# EAGLE design qtwov3_schem (EAGLE 7.6.0)
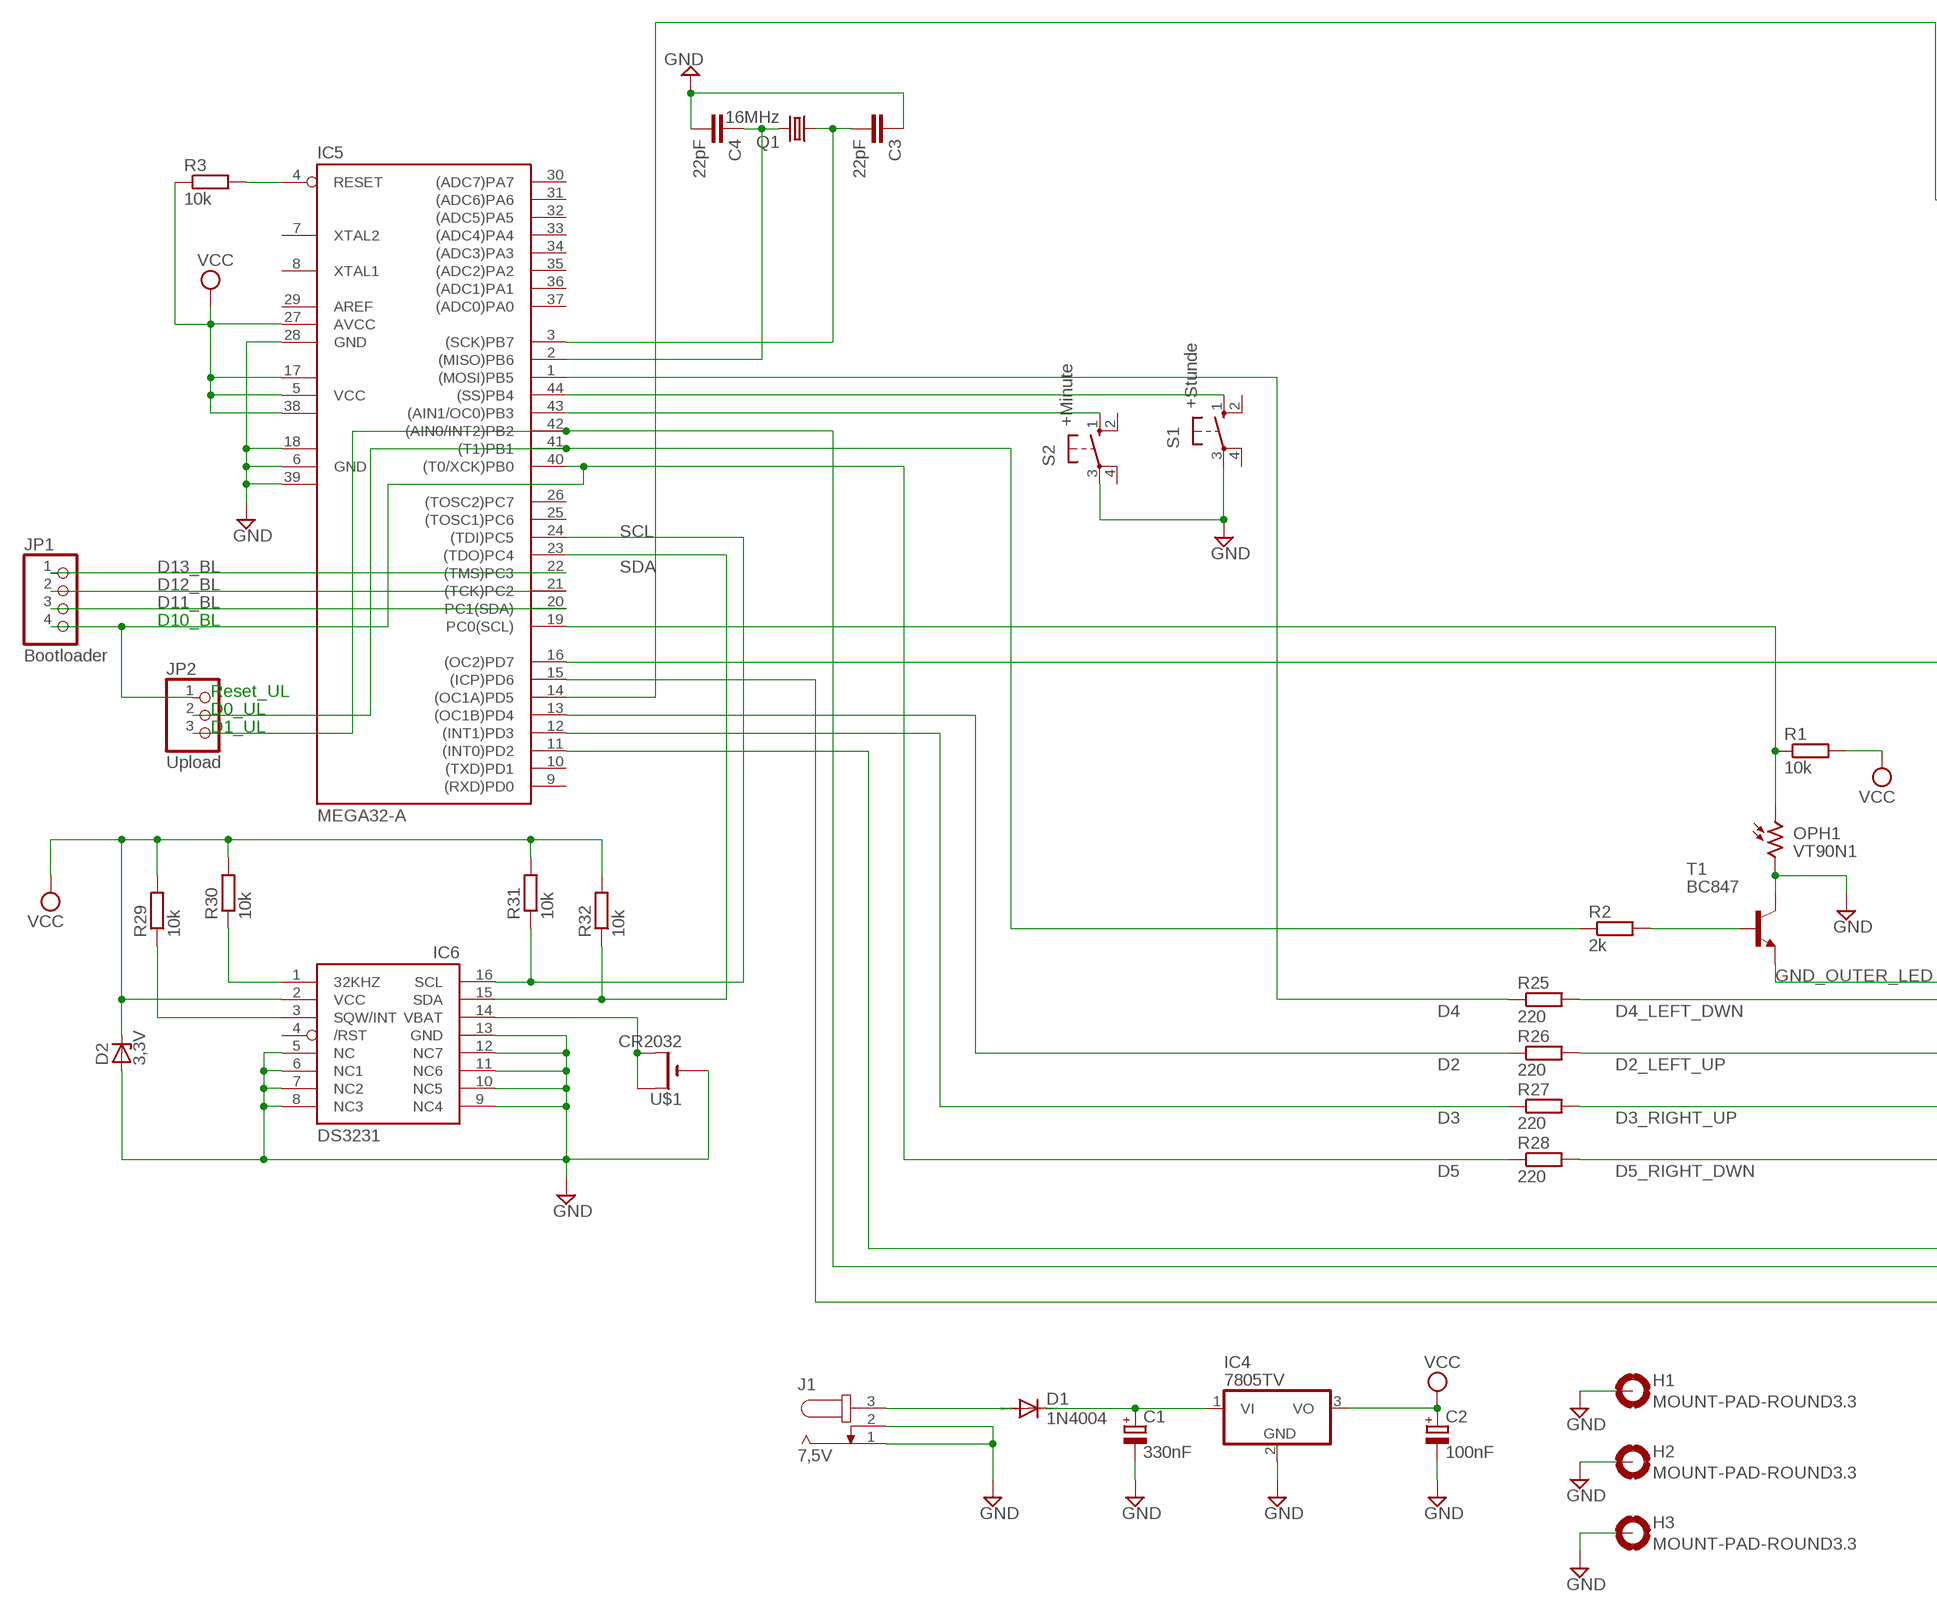
[diagram p0: schematic, sheet 1, part 1 of 2]
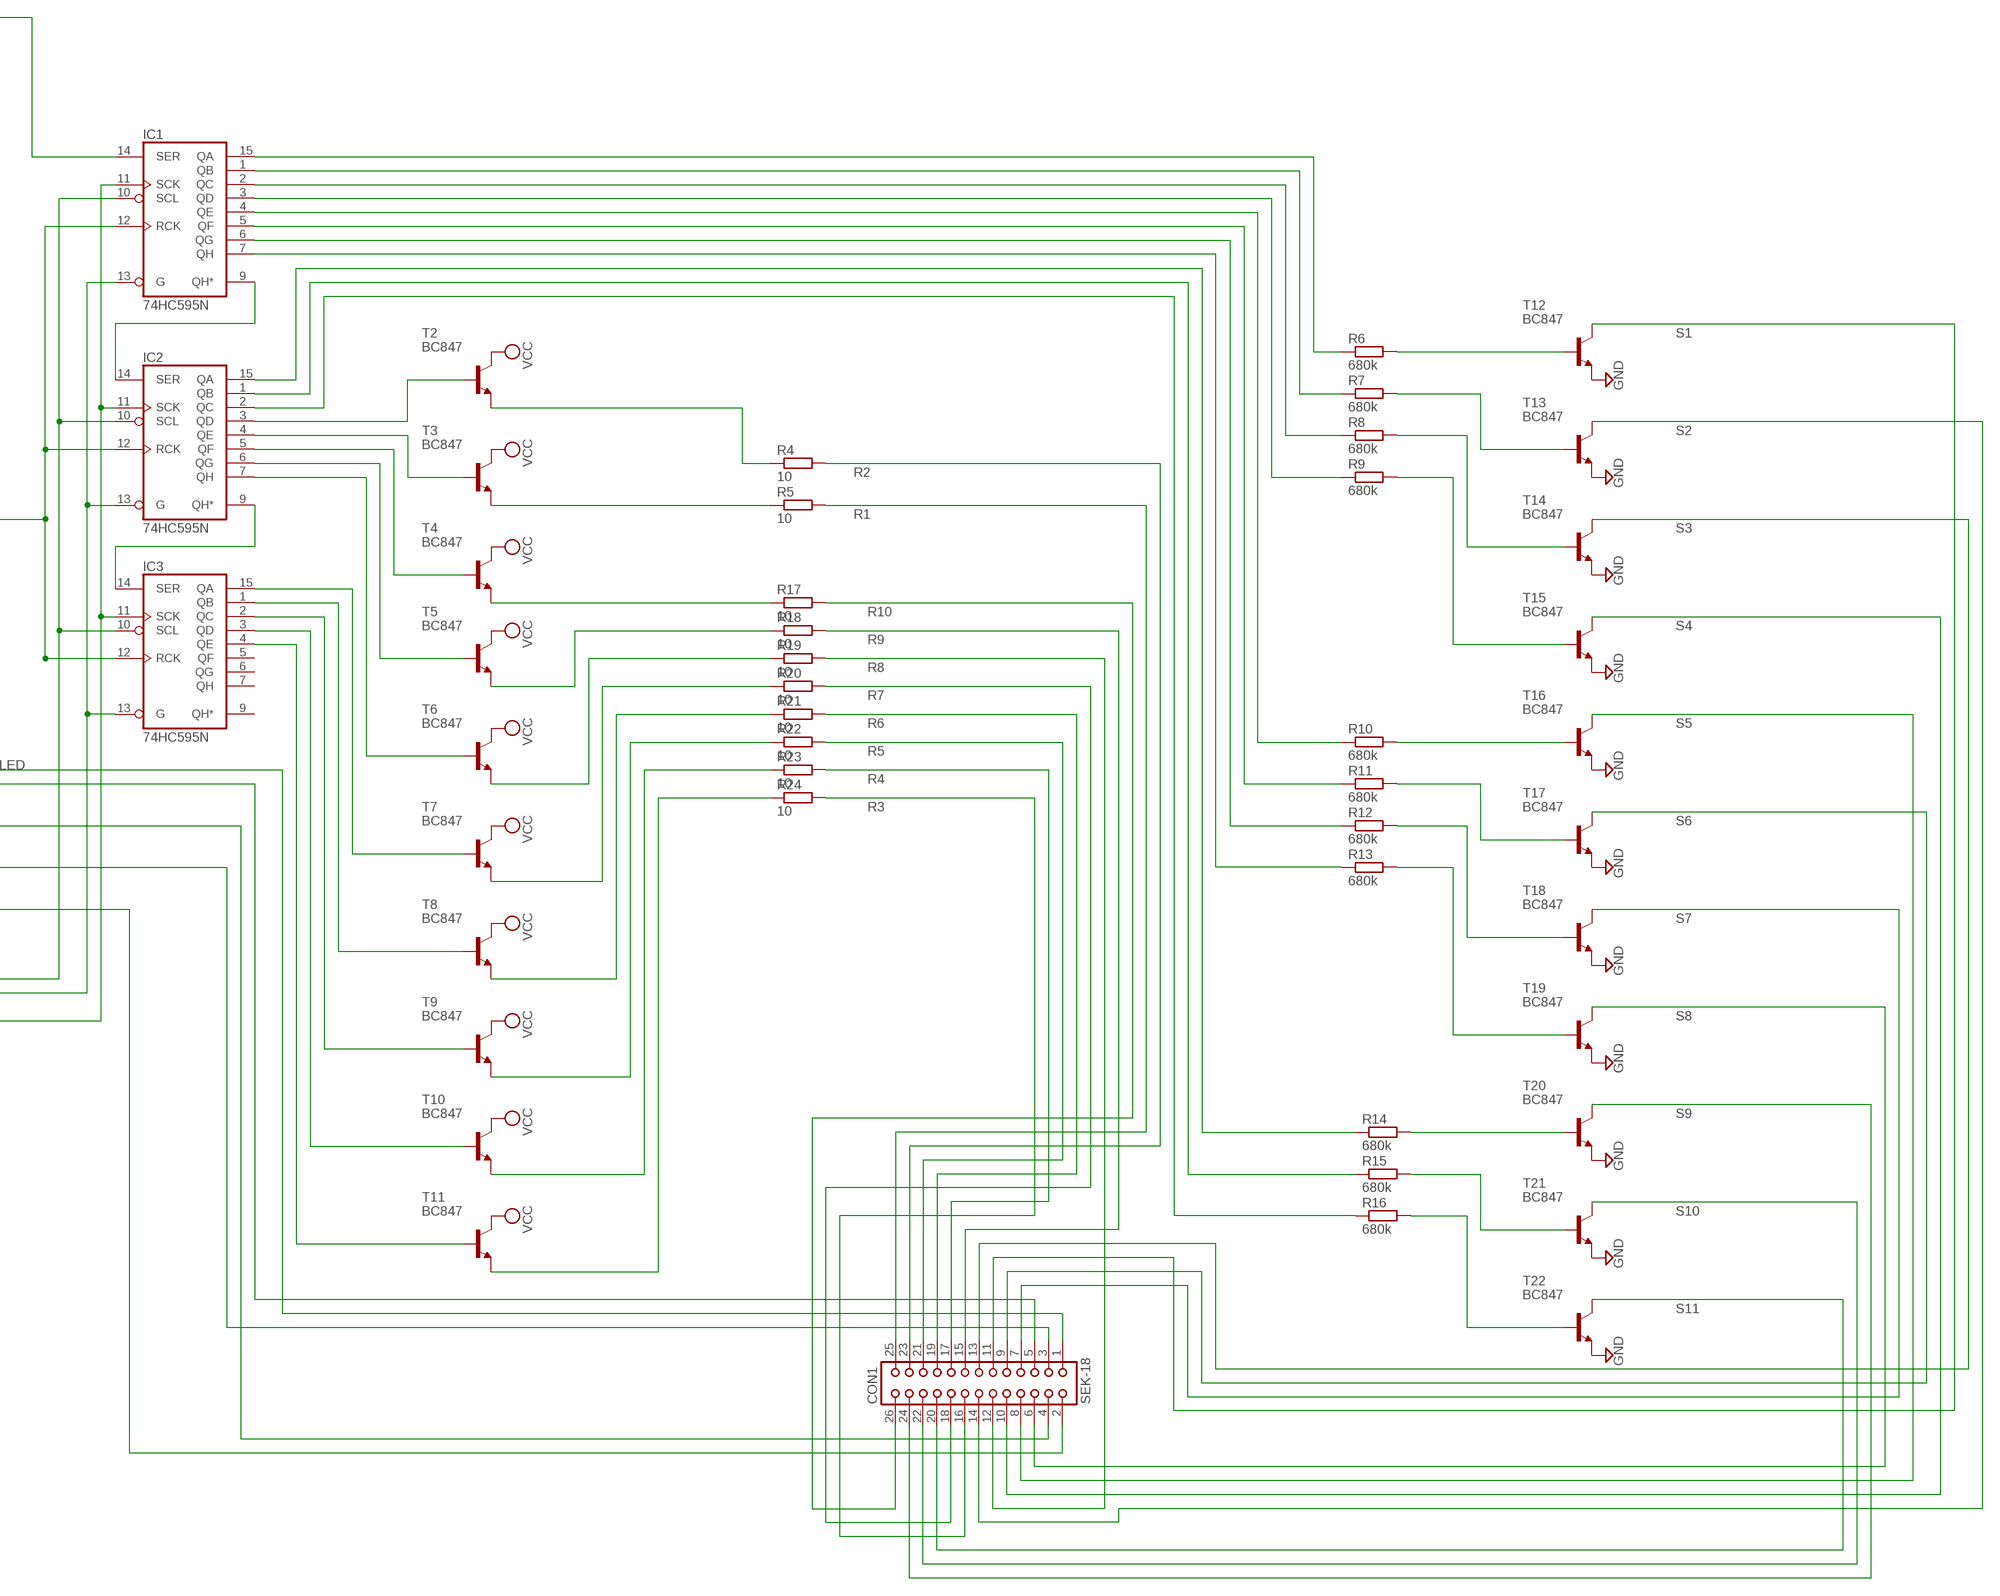
[diagram p1: schematic, sheet 1, part 2 of 2]

## Parts
C1  330nF  CPOL-EUA/3216-18R  [A/3216-18R]
C2  100nF  CPOL-EUA/3216-18R  [A/3216-18R]
C3  22pF  C-EUC3216  [C3216]
C4  22pF  C-EUC3216  [C3216]
CON1  SEK-18  CON26  [CON26]
D1  1N4004  [DO41-10]
D2  3,3V  ZENER-DIODEP1-12  [P1Z12]
H1  MOUNT-PAD-ROUND3.3  [3,3-PAD]
H2  MOUNT-PAD-ROUND3.3  [3,3-PAD]
H3  MOUNT-PAD-ROUND3.3  [3,3-PAD]
IC1  74HC595N  [DIL16]
IC2  74HC595N  [DIL16]
IC3  74HC595N  [DIL16]
IC4  7805TV  [TO220V]
IC5  MEGA32-A  [TQFP44]
IC6  DS3231/SO  [SO16W]
J1  7,5V  JACK-PLUG1  [SPC4078]
JP1  Bootloader  PINHD-1X4  [1X04]
JP2  Upload  PINHD-1X3  [1X03]
OPH1  VT90N1  [VT900]
Q1  16MHz  CRYSTALHC49S  [HC49/S]
R1  10k  R-EU_M3216  [M3216]
R2  2k  R-EU_M3216  [M3216]
R3  10k  R-EU_M3216  [M3216]
R4  10  R-EU_M3216  [M3216]
R5  10  R-EU_M3216  [M3216]
R6  680k  R-EU_M3216  [M3216]
R7  680k  R-EU_M3216  [M3216]
R8  680k  R-EU_M3216  [M3216]
R9  680k  R-EU_M3216  [M3216]
R10  680k  R-EU_M3216  [M3216]
R11  680k  R-EU_M3216  [M3216]
R12  680k  R-EU_M3216  [M3216]
R13  680k  R-EU_M3216  [M3216]
R14  680k  R-EU_M3216  [M3216]
R15  680k  R-EU_M3216  [M3216]
R16  680k  R-EU_M3216  [M3216]
R17  10  R-EU_M3216  [M3216]
R18  10  R-EU_M3216  [M3216]
R19  10  R-EU_M3216  [M3216]
R20  10  R-EU_M3216  [M3216]
R21  10  R-EU_M3216  [M3216]
R22  10  R-EU_M3216  [M3216]
R23  10  R-EU_M3216  [M3216]
R24  10  R-EU_M3216  [M3216]
R25  220  R-EU_M3216  [M3216]
R26  220  R-EU_M3216  [M3216]
R27  220  R-EU_M3216  [M3216]
R28  220  R-EU_M3216  [M3216]
R29  10k  R-EU_M3216  [M3216]
R30  10k  R-EU_M3216  [M3216]
R31  10k  R-EU_M3216  [M3216]
R32  10k  R-EU_M3216  [M3216]
S1  +Stunde  10-XX  [B3F-10XX]
S2  +Minute  10-XX  [B3F-10XX]
T1  BC847  [SOT23]
T2  BC847  [SOT23]
T3  BC847  [SOT23]
T4  BC847  [SOT23]
T5  BC847  [SOT23]
T6  BC847  [SOT23]
T7  BC847  [SOT23]
T8  BC847  [SOT23]
T9  BC847  [SOT23]
T10  BC847  [SOT23]
T11  BC847  [SOT23]
T12  BC847  [SOT23]
T13  BC847  [SOT23]
T14  BC847  [SOT23]
T15  BC847  [SOT23]
T16  BC847  [SOT23]
T17  BC847  [SOT23]
T18  BC847  [SOT23]
T19  BC847  [SOT23]
T20  BC847  [SOT23]
T21  BC847  [SOT23]
T22  BC847  [SOT23]
U$1  CR2032  CR2032THM  [CR2032-THRU]

## Nets
D2: IC5.13((OC1B)PD4) R26.1
D2_LEFT_UP: CON1.4 R26.2
D3: IC5.12((INT1)PD3) R27.1
D3_RIGHT_UP: CON1.3 R27.2
D4: IC5.1((MOSI)PB5) R25.1
D4_LEFT_DWN: CON1.5 R25.2
D5: IC5.40((T0/XCK)PB0) JP1.4 JP2.1 R28.1
D5_RIGHT_DWN: CON1.2 R28.2
D11_BL: IC5.20(PC1(SDA)) JP1.3
D12_BL: IC5.21((TCK)PC2) JP1.2
D13_BL: IC5.22((TMS)PC3) JP1.1
GND: C1.- C2.- C3.1 C4.2 D2.A H1.B3,3(MOUNT) H2.B3,3(MOUNT) H3.B3,3(MOUNT) IC4.2(GND) IC5.6(GND) IC5.18(GND1) IC5.28(GND) IC5.39(GND2) IC6.5(NC) IC6.6(NC1) IC6.7(NC2) IC6.8(NC3) IC6.9(NC4) IC6.10(NC5) IC6.11(NC6) IC6.12(NC7) IC6.13(GND) J1.1 J1.2 OPH1.2 S1.3(P) S2.3(P) T1.3(C) T12.2(E) T13.2(E) T14.2(E) T15.2(E) T16.2(E) T17.2(E) T18.2(E) T19.2(E) T20.2(E) T21.2(E) T22.2(E) U$1.-
GND_OUTER_LED: CON1.1 T1.2(E)
N$1: C1.+ D1.C IC4.1(VI)
N$2: D1.A J1.3
N$3: IC6.1(32KHZ) R30.1
N$4: IC6.3(SQW/INT) R29.1
N$5: IC5.19(PC0(SCL)) OPH1.1 R1.1
N$6: IC5.44((SS)PB4) S1.1(S)
N$7: IC5.43((AIN1/OC0)PB3) S2.1(S)
N$8: IC1.10(SCL) IC2.10(SCL) IC3.10(SCL) IC5.11((INT0)PD2)
N$9: IC5.41((T1)PB1) JP2.2 R2.1
N$10: R2.2 T1.1(B)
N$11: IC1.13(G) IC2.13(G) IC3.13(G) IC5.42((AIN0/INT2)PB2) JP2.3
N$12: IC1.11(SCK) IC2.11(SCK) IC3.11(SCK) IC5.15((ICP)PD6)
N$13: IC1.12(RCK) IC2.12(RCK) IC3.12(RCK) IC5.16((OC2)PD7)
N$14: IC1.14(SER) IC5.14((OC1A)PD5)
N$15: IC1.9(QH*) IC2.14(SER)
N$16: IC2.9(QH*) IC3.14(SER)
N$17: IC2.3(QD) T2.1(B)
N$18: IC2.4(QE) T3.1(B)
N$19: IC2.5(QF) T4.1(B)
N$20: IC2.6(QG) T5.1(B)
N$21: IC2.7(QH) T6.1(B)
N$22: IC3.15(QA) T7.1(B)
N$23: IC3.1(QB) T8.1(B)
N$24: IC3.2(QC) T9.1(B)
N$25: IC3.3(QD) T10.1(B)
N$26: IC3.4(QE) T11.1(B)
N$27: R6.2 T12.1(B)
N$28: R7.2 T13.1(B)
N$29: R8.2 T14.1(B)
N$30: R9.2 T15.1(B)
N$31: R10.2 T16.1(B)
N$32: R11.2 T17.1(B)
N$33: R12.2 T18.1(B)
N$34: R13.2 T19.1(B)
N$35: R14.2 T20.1(B)
N$36: R15.2 T21.1(B)
N$37: R16.2 T22.1(B)
N$38: IC1.15(QA) R6.1
N$39: IC1.1(QB) R7.1
N$40: IC1.2(QC) R8.1
N$41: IC1.3(QD) R9.1
N$42: IC1.4(QE) R10.1
N$43: IC1.5(QF) R11.1
N$44: IC1.6(QG) R12.1
N$45: IC1.7(QH) R13.1
N$46: IC2.15(QA) R14.1
N$47: IC2.1(QB) R15.1
N$48: IC2.2(QC) R16.1
N$49: R4.1 T2.2(E)
N$50: R5.1 T3.2(E)
N$51: R17.1 T4.2(E)
N$52: R18.1 T5.2(E)
N$53: R19.1 T6.2(E)
N$54: R20.1 T7.2(E)
N$55: R21.1 T8.2(E)
N$56: R22.1 T9.2(E)
N$57: R23.1 T10.2(E)
N$58: R24.1 T11.2(E)
N$59: IC6.14(VBAT) U$1.+1(+) U$1.+2(+1)
N$60: C4.1 IC5.2((MISO)PB6) Q1.2
N$61: C3.2 IC5.3((SCK)PB7) Q1.1
N$62: IC5.4(RESET) R3.2
R1: CON1.25 R5.2
R2: CON1.23 R4.2
R3: CON1.16 R24.2
R4: CON1.17 R23.2
R5: CON1.21 R22.2
R6: CON1.19 R21.2
R7: CON1.18 R20.2
R8: CON1.12 R19.2
R9: CON1.15 R18.2
R10: CON1.26 R17.2
S1: CON1.11 T12.3(C)
S2: CON1.14 T13.3(C)
S3: CON1.13 T14.3(C)
S4: CON1.10 T15.3(C)
S5: CON1.8 T16.3(C)
S6: CON1.9 T17.3(C)
S7: CON1.7 T18.3(C)
S8: CON1.6 T19.3(C)
S9: CON1.24 T20.3(C)
S10: CON1.22 T21.3(C)
S11: CON1.20 T22.3(C)
SCL: IC5.24((TDI)PC5) IC6.16(SCL) R31.1
SDA: IC5.23((TDO)PC4) IC6.15(SDA) R32.1
VCC: C2.+ D2.C IC4.3(VO) IC5.5(VCC) IC5.17(VCC1) IC5.27(AVCC) IC5.38(VCC2) IC6.2(VCC) R1.2 R3.1 R29.2 R30.2 R31.2 R32.2 T2.3(C) T3.3(C) T4.3(C) T5.3(C) T6.3(C) T7.3(C) T8.3(C) T9.3(C) T10.3(C) T11.3(C)
Unconnected: IC3.5(QF) IC3.6(QG) IC3.7(QH) IC3.9(QH*) IC5.7(XTAL2) IC5.8(XTAL1) IC5.9((RXD)PD0) IC5.10((TXD)PD1) IC5.25((TOSC1)PC6) IC5.26((TOSC2)PC7) IC5.29(AREF) IC5.30((ADC7)PA7) IC5.31((ADC6)PA6) IC5.32((ADC5)PA5) IC5.33((ADC4)PA4) IC5.34((ADC3)PA3) IC5.35((ADC2)PA2) IC5.36((ADC1)PA1) IC5.37((ADC0)PA0) IC6.4(/RST) S1.2(S1) S1.4(P1) S2.2(S1) S2.4(P1)

## Notes on the sheet
- D10_BL
- Reset_UL
- D0_UL
- D1_UL

## Power pins joined to a net without a drawn wire
GND: IC1.8(GND) IC2.8(GND) IC3.8(GND)
VCC: IC1.16(VCC) IC2.16(VCC) IC3.16(VCC)

## Library data of the parts
C1 C2 = rcl:CPOL-EU: POLARIZED CAPACITOR, European symbol
C3 C4 = rcl:C-EU: CAPACITOR, European symbol
CON1 = con-harting:CON26: CONNECTOR; OC_FARNELL: unknown; OC_NEWARK: unknown
D1 = diode:1N4004: DIODE general purpose rectifier, 1 A
D2 = diode:ZENER-DIODE: Z-Diode
H1-H3 = holes:MOUNT-PAD-ROUND: MOUNTING PAD, round
IC1-IC3 = 74xx-eu:74*595: 8-bit SHIFT REGISTER, output latch
IC4 = linear:78*: Positive VOLTAGE REGULATOR Source: http://cache.national.com/ds/LM/LM78L05.pdf http://www.fairchildsemi.com/ds/LM/LM7805.pdf
IC5 = atmel:MEGA32: MICROCONTROLLER 32 Kbytes FLASH 2 Kbytes SRAM 1 Kbytes EEPROM USART 8-channel 10 bit ADC Source: www.atmel.com .. doc2503.pdf; MPN: ATMEGA32-16AU; OC_FARNELL: 9171274; OC_NEWARK: 69K6677
IC6 = adafruit:DS3231
J1 = con-jack:JACK-PLUG: DC POWER JACK Power Jack, DC, Right Angle, Through Hole, Rated 5A at 16VDC, PC Terminals Distributor: Farnell (www.Farnell.de) Drawing: 84N1161.pdf / 84N1162.pdf Manufacturer: SPC Technology (www.spctechnology.com) Type: SPC4077 / SPC 4078; OC_FARNELL: unknown; OC_NEWARK: unknown
JP1 = pinhead:PINHD-1X4: PIN HEADER
JP2 = pinhead:PINHD-1X3: PIN HEADER
OPH1 = photo-elements:VT9: Photoconductive Cell VT900 Series Source: http://optoelectronics.perkinelmer.com/content/Datasheets/DTS_vt900seriesdatasheet.pdf
Q1 = crystal:CRYSTAL: CRYSTAL; OC_FARNELL: 1667008; OC_NEWARK: unknown
R1-R32 = rcl:R-EU_: RESISTOR, European symbol
S1 S2 = switch-omron:10-XX: OMRON SWITCH; MPN: B3F-1000; OC_FARNELL: 176432; OC_NEWARK: 36M3542
T1-T22 = transistor:BC847: NPN TRANSISTOR
U$1 = adafruit:CR2032

## Board
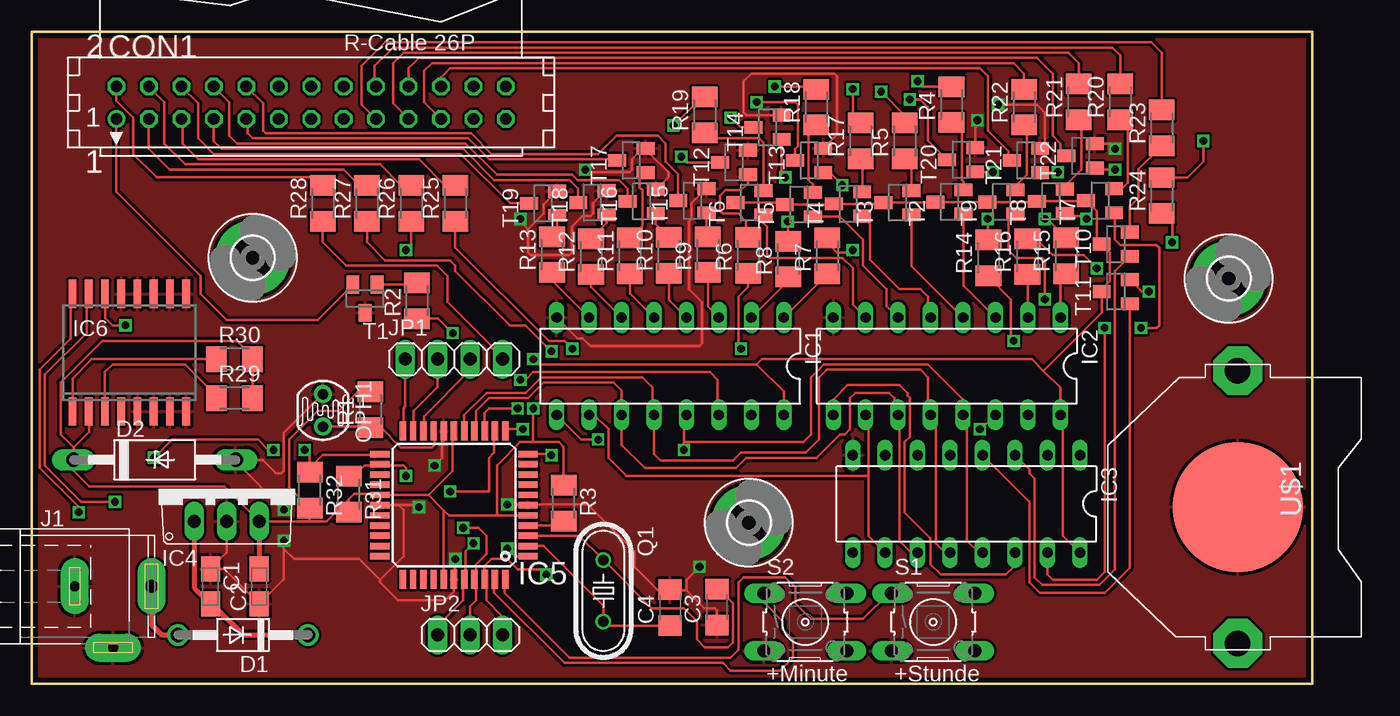
[diagram p2: board, top side]
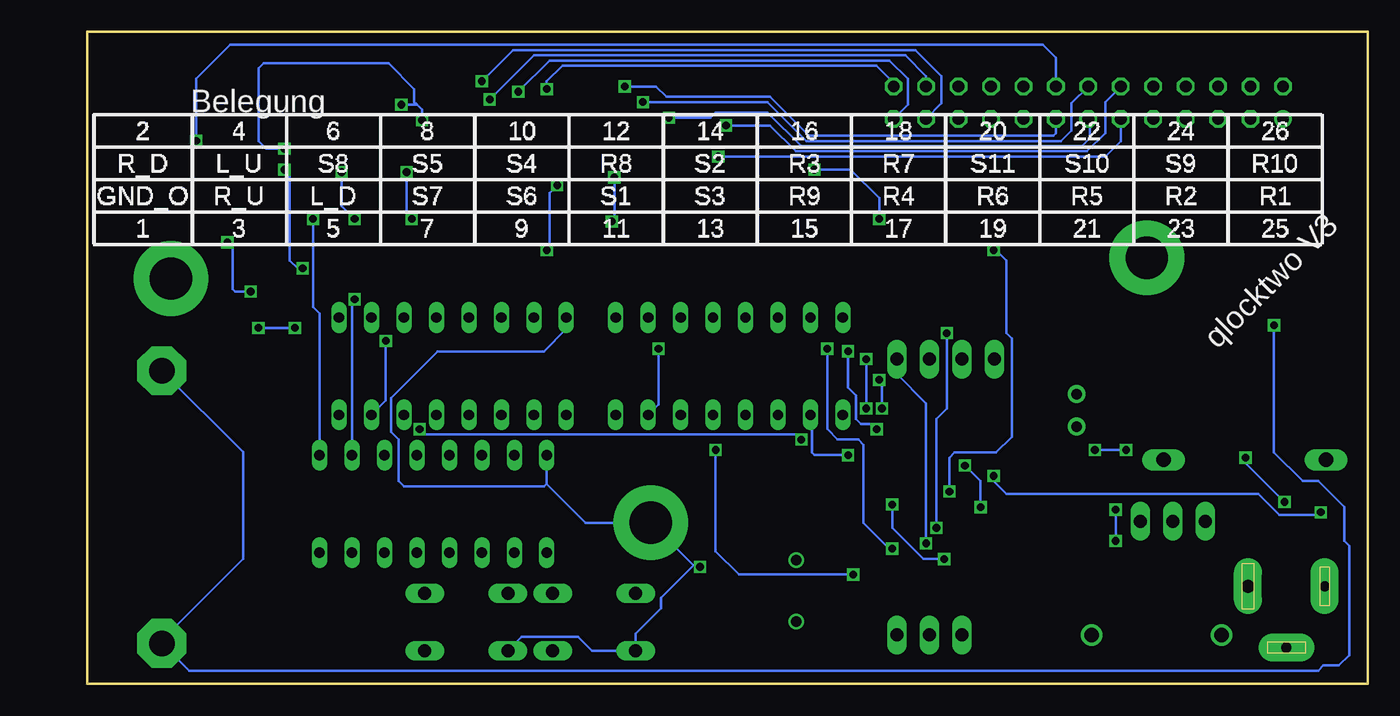
[diagram p3: board, bottom side, seen from below]

Size 100.18 x 51 mm. Coordinates in mm from the lower left corner, seen from the top.
Outline: 0,0 100.18,0 100.18,51 0,51 0,0
Copper layers (1*16): Top 0.0356mm / dielectric 1.5011mm / Bottom 0.0356mm
Design rules "oshpark-2layer": minimum track width 8mil, minimum drill 13mil, track to track 8mil, track to pad 8mil, pad to pad 8mil, via to via 8mil, smd to smd 8mil, copper to edge 15mil, drill to drill 8mil, minimum pad ring 7mil, minimum via ring 7mil, stop-mask expansion 2.5mil, vias tented up to drill 0mil, thermal gap 10mil

### Footprints (pad centres in the part's own frame; a part is rotated, then mirrored left to right if it is on the bottom)
A/3216-18R = smd 1.95 x 1.5: + 1.375,0; - -1.375,0
C3216 = smd 1.6 x 1.8: 1 -1.4,0; 2 1.4,0
CON26 = drill 0.914: 1 -15.24,-1.27 | drill 0.914 octagon: 2 -15.24,1.27; 3 -12.7,-1.27; 4 -12.7,1.27; 5 -10.16,-1.27; 6 -10.16,1.27; 7 -7.62,-1.27; 8 -7.62,1.27; 9 -5.08,-1.27; 10 -5.08,1.27; 11 -2.54,-1.27; 12 -2.54,1.27; 13 0,-1.27; 14 0,1.27; 15 2.54,-1.27; 16 2.54,1.27; 17 5.08,-1.27; 18 5.08,1.27; 19 7.62,-1.27; 20 7.62,1.27; 21 10.16,-1.27; 22 10.16,1.27; 23 12.7,-1.27; 24 12.7,1.27; 25 15.24,-1.27; 26 15.24,1.27
DO41-10 = drill 1.118: A 5.08,0; C -5.08,0
P1Z12 = drill 1.118 long: A 6.35,0; C -6.35,0
3,3-PAD = drill 3.3 pad 5.842: B3,3 0,0
DIL16 = drill 0.813 long: 1 -8.89,-3.81; 2 -6.35,-3.81; 3 -3.81,-3.81; 4 -1.27,-3.81; 5 1.27,-3.81; 6 3.81,-3.81; 7 6.35,-3.81; 8 8.89,-3.81; 9 8.89,3.81; 10 6.35,3.81; 11 3.81,3.81; 12 1.27,3.81; 13 -1.27,3.81; 14 -3.81,3.81; 15 -6.35,3.81; 16 -8.89,3.81
TO220V = drill 1.016 long: 1 -2.54,-2.54; 2 0,-2.54; 3 2.54,-2.54
TQFP44 = smd 1.5 x 0.5: 1 -5.8,4; 2 -5.8,3.2; 3 -5.8,2.4; 4 -5.8,1.6; 5 -5.8,0.8; 6 -5.8,0; 7 -5.8,-0.8; 8 -5.8,-1.6; 9 -5.8,-2.4; 10 -5.8,-3.2; 11 -5.8,-4; 23 5.8,-4; 24 5.8,-3.2; 25 5.8,-2.4; 26 5.8,-1.6; 27 5.8,-0.8; 28 5.8,0; 29 5.8,0.8; 30 5.8,1.6; 31 5.8,2.4; 32 5.8,3.2; 33 5.8,4 | smd 0.5 x 1.5: 12 -4,-5.8; 13 -3.2,-5.8; 14 -2.4,-5.8; 15 -1.6,-5.8; 16 -0.8,-5.8; 17 0,-5.8; 18 0.8,-5.8; 19 1.6,-5.8; 20 2.4,-5.8; 21 3.2,-5.8; 22 4,-5.8; 34 4,5.8; 35 3.2,5.8; 36 2.4,5.8; 37 1.6,5.8; 38 0.8,5.8; 39 0,5.8; 40 -0.8,5.8; 41 -1.6,5.8; 42 -2.4,5.8; 43 -3.2,5.8; 44 -4,5.8
SO16W = smd 0.6 x 2.2: 1 -4.445,-4.6; 2 -3.175,-4.6; 3 -1.905,-4.6; 4 -0.635,-4.6; 5 0.635,-4.6; 6 1.905,-4.6; 7 3.175,-4.6; 8 4.445,-4.6; 9 4.445,4.6; 10 3.175,4.6; 11 1.905,4.6; 12 0.635,4.6; 13 -0.635,4.6; 14 -1.905,4.6; 15 -3.175,4.6; 16 -4.445,4.6
SPC4078 = drill 0.8 pad 2.184 long: 1 -3,0; 2 0,-4.8 | drill 1 pad 2.184 long: 3 3,0
1X04 = drill 1.016 long: 1 -3.81,0; 2 -1.27,0; 3 1.27,0; 4 3.81,0
1X03 = drill 1.016 long: 1 -2.54,0; 2 0,0; 3 2.54,0
VT900 = drill 0.8 pad 1.4: 1 -1.27,0; 2 1.27,0
HC49/S = drill 0.813: 1 -2.413,0; 2 2.413,0
M3216 = smd 1.6 x 2: 1 -1.4,0; 2 1.4,0
B3F-10XX = drill 1.016 long: 1 -3.251,2.261; 2 3.251,2.261; 3 -3.251,-2.261; 4 3.251,-2.261
SOT23 = smd 1 x 1.4: 1 -0.95,-1.1; 2 0.95,-1.1; 3 0,1.1
CR2032-THRU = drill 2 pad 3.81 octagon: +1 -10.668,0; +2 10.668,0 | smd 10.16 x 10.16: - 0,0

### Placement (x,y rotation side)
C1  13.97,7.62 270 top
C2  17.78,7.62 90 top
C3  53.59,5.99 90 top
C4  49.94,5.94 90 top
CON1  21.84,45.47 0 top
D1  16.51,3.81 180 top
D2  9.6,17.53 0 top
H1  93.62,31.7 0 top
H2  56.08,12.6 0 top
H3  17.27,33.32 0 top
IC1  49.94,24.84 180 top
IC2  71.58,24.84 180 top
IC3  73.1,14.07 180 top
IC4  15.24,15.24 0 top
IC5  33.02,13.97 180 top
IC6  7.62,25.91 0 top
J1  6.35,7.62 0 top
JP1  33.02,25.4 0 top
JP2  34.29,3.81 0 top
OPH1  22.76,21.39 90 top
Q1  44.7,7.26 270 top
R1  26.47,21.44 90 top
R2  30.12,29.97 90 top
R3  41.61,14.12 270 top
R4  71.93,45.31 90 top
R5  68.28,42.47 90 top
R6  56.03,33.53 90 top
R7  62.23,33.48 90 top
R8  59.18,33.22 90 top
R9  52.88,33.58 90 top
R10  49.83,33.53 90 top
R11  46.79,33.48 90 top
R12  43.74,33.43 90 top
R13  40.69,33.58 90 top
R14  74.83,33.32 90 top
R15  80.92,33.48 90 top
R16  77.88,33.43 90 top
R17  64.82,42.47 90 top
R18  61.37,45.11 90 top
R19  52.63,44.5 90 top
R20  85.14,45.52 90 top
R21  81.89,45.52 90 top
R22  77.62,45.11 90 top
R23  88.39,43.48 90 top
R24  88.39,38.2 90 top
R25  33.12,37.59 90 top
R26  29.67,37.59 90 top
R27  26.21,37.59 90 top
R28  22.76,37.59 90 top
R29  15.85,22.35 0 top
R30  15.85,25.4 0 top
R31  24.79,14.83 270 top
R32  21.74,15.14 270 top
S1  70.51,4.83 0 top
S2  60.5,4.83 0 top
T1  26.06,30.12 180 top
T2  71.78,37.69 90 top
T3  67.72,37.64 90 top
T4  63.86,37.54 90 top
T5  59.99,37.49 90 top
T6  56.13,37.64 90 top
T7  83.57,37.8 90 top
T8  79.71,37.74 90 top
T9  75.84,37.69 90 top
T10  84.79,34.39 90 top
T11  84.79,30.68 90 top
T12  54.91,40.79 90 top
T13  60.81,40.94 90 top
T14  57.56,43.54 90 top
T15  51.66,37.8 90 top
T16  47.7,37.74 90 top
T17  46.89,40.94 90 top
T18  43.84,37.64 90 top
T19  39.98,37.59 90 top
T20  72.69,41 90 top
T21  77.77,40.94 90 top
T22  82.04,41.3 90 top
U$1  94.34,13.82 270 top

### Tracks (layer width: path | path; a pad name or v marks a point on that pad's centre or on a via)
D2  (via drill 0.6)
  Top 0.203: R26.1 29.67,34.34 v29.26,33.93 | v32.72,15.04 35.76,15.04 35.76,17.68 36.17,18.09 36.17,19.72 IC5.13
  Bottom 0.203: v29.26,33.93 29.06,33.93 28.25,33.12 28.25,27.43 27.84,27.03 27.84,19.3 29.06,18.09 32.31,18.09 32.72,17.68 v32.72,15.04
D2_LEFT_UP
  Top 0.203: R26.2 28.88,38.99 27.23,40.64 11.99,40.64 10.36,42.27 10.36,45.52 CON1.4
D3  (via drill 0.6)
  Top 0.203: R27.1 26.21,34.54 27.64,33.12 32.72,33.12 33.12,32.72 33.12,32.31 37.39,28.04 38.61,28.04 v40.64,26.01 | v38.41,19.91 37.16,19.91 IC5.12
  Bottom 0.203: v40.64,26.01 40.64,23.16 40.03,22.55 40.03,20.73 39.62,20.32 38.81,20.32 v38.41,19.91 38.61,20.12
D3_RIGHT_UP
  Top 0.203: R27.2 25.63,38.99 24.38,40.23 10.77,40.23 9.14,41.86 CON1.3
D4  (via drill 0.6)
  Top 0.203: R25.1 33.12,34.14 40.44,26.82 41.66,26.82 v42.27,26.21 | v37.19,10.57 37.8,9.96 38.81,9.96 IC5.1
  Bottom 0.203: v42.27,26.21 42.27,19.91 41.45,19.1 39.83,19.1 39.42,18.69 39.42,12.6 37.39,10.57 v37.19,10.57
D4_LEFT_DWN
  Top 0.203: R25.2 32.33,38.99 30.28,41.05 13.01,41.05 11.79,42.27 11.79,44.09 CON1.5
D5  (via drill 0.6)
  Top 0.203: JP2.1 31.75,4.52 33.73,6.5 33.73,8.08 IC5.40 33.93,8.28 33.93,10.36 v34.54,10.97 | R28.1 22.76,34.54 24.59,32.72 31.7,32.72 32.51,31.9 32.51,29.87 35.97,26.42 35.97,26.26 JP1.4
  Bottom 0.203: JP1.4 36.83,24.23 34.54,21.95 v34.54,10.97
D5_RIGHT_DWN
  Top 0.203: R28.2 22.13,39.62 9.75,39.62 7.92,41.45 7.92,44.3 6.6,45.62 CON1.2
D11_BL
  Top 0.203: JP1.3 34.29,24.54 30.68,20.93 30.68,19.83 IC5.20
D12_BL
  Top 0.203: JP1.2 31.75,23.22 29.87,21.34 29.87,19.82 IC5.21
D13_BL
  Top 0.203: JP1.1 29.21,21.69 29.06,21.54 29.06,19.81 IC5.22
GND  (via drill 0.6)
  Top 0.203: C3.1 53.59,5.74 53.44,5.89 52.63,5.89 51.21,7.32 | 51.21,7.32 49.97,7.32 C4.2 48.94,7.34 47.14,9.14 47.14,10.36 43.48,14.02 38.87,14.02 IC5.6 38.77,14.02 v37.19,14.02 | v19.71,13.61 15.95,17.37 D2.A 18.03,17.53 19.1,16.46 19.51,16.46 19.71,16.66 19.71,19.61 OPH1.2 | v19.71,11.18 19.71,10.57 | 19.71,10.57 19.71,8.18 C2.- 15.03,8.99 C1.- 15.24,10.27 IC4.2 | 51.21,7.32 51.21,8.13 v52.22,9.14 | IC5.28 28.7,13.97 | 28.7,13.97 29.06,13.61 29.06,9.96 27.23,8.13 | 27.23,8.13 27.23,7.92 28.65,6.5 32.31,6.5 33.02,7.21 IC5.39 33.12,8.27 v33.12,9.75 | 19.71,10.57 20.52,9.75 25.6,9.75 27.23,8.13 | v31.5,17.07 32.11,17.68 32.11,19.66 IC5.18 | 28.7,13.97 30.12,13.97 v30.28,13.82 | T18.2 44.89,38.59 43.89,37.59 43.89,36.78 43.69,36.58 43.08,36.58 42.27,35.76 42.27,33.73 42.06,33.53 39.01,33.53 38.81,33.73 38.81,35.56 | 38.81,35.56 40.03,36.78 40.03,37.49 T19.2 | T14.2 55.9,44.49 55.68,44.7 55.68,47.14 56.29,47.75 62.79,47.75 62.99,47.55 62.99,42.98 T13.2 | T20.2 73.8,43.92 v73.97,44.09 | v75.59,45.31 78.64,45.31 79.25,44.7 79.25,42.27 T21.2 | T22.2 84.34,42.25 v84.73,41.86 | T16.2 48.85,38.69 49.78,39.62 49.78,40.03 48.36,41.45 | 48.36,41.45 48.36,41.52 T17.2 | T15.2 51.61,37.59 51.61,36.37 51.41,36.17 51.41,30.89 52.43,29.87 52.43,26.62 52.22,26.42 43.69,26.42 43.08,27.03 42.67,27.03 IC1.8 | 48.36,41.45 48.16,41.66 47.55,41.66 46.94,41.05 46.94,40.23 46.74,40.03 43.48,40.03 v43.28,40.23 | v38.2,36.37 38.2,36.17 38.81,35.56
  Bottom 0.203: v19.71,13.61 v19.71,11.18 | IC3.8 64.21,15.65 | 64.21,15.65 61.16,12.6 H2.B3,3 52.73,9.25 | IC2.8 62.69,27.74 64.41,26.01 72.75,26.01 76.4,22.35 76.4,19.71 75.79,19.1 75.79,15.85 75.39,15.44 64.41,15.44 64.21,15.65 | v52.22,9.14 52.63,9.14 52.73,9.25 | 52.73,9.25 55.27,6.71 55.27,5.89 57.25,3.91 S2.3 60.68,2.56 61.77,3.66 66.17,3.66 S1.3 | v30.28,13.82 30.28,15.85 v31.5,17.07 | v37.19,14.02 37.19,12.19 34.75,9.75 v33.12,9.75 | v73.97,44.09 73.97,44.91 74.37,45.31 | 74.37,45.31 v75.59,45.31 | v84.73,41.86 86.16,41.86 86.77,42.47 86.77,48.16 86.36,48.56 76.61,48.56 74.57,46.53 74.57,45.52 74.37,45.31 | v43.28,40.23 40.44,40.23 38.2,38 v38.2,36.37
  pour Top: 0.61,0.41 0.2,0.41 0.2,50.19 0.2,50.6 99.77,50.6 99.77,0.41
GND_OUTER_LED
  Top 0.203: T1.2 22.33,28.45 15.24,28.45 13.21,30.48 13.21,31.9 6.6,38.51 CON1.1
N$1
  Top 0.406: IC4.1 12.7,7.51 C1.+ 14.07,6.25 16.51,3.81 D1.C
N$2
  Top 0.406: J1.3 9.35,4.62 10.16,3.81 D1.A
N$3
  Top 0.203: IC6.1 3.17,23.9 4.67,25.4 R30.1
N$4
  Top 0.203: R29.1 14.45,22.53 11.99,24.99 6.3,24.99 5.69,24.38 5.69,21.33 IC6.3
N$5
  Top 0.203: OPH1.1 26.39,20.12 R1.1 27.31,20.04 28.85,18.49 31.29,18.49 31.5,18.69 31.5,19.69 IC5.19
N$6
  Top 0.203: S1.1 67.03,7.09 65.02,5.08 60.96,5.08 59.74,6.3 59.74,7.52 58.93,8.33 55.68,8.33 55.27,7.92 55.27,2.64 54.66,2.03 42.06,2.03 36.98,7.11 36.98,8.13 IC5.44
N$7
  Top 0.203: IC5.43 36.17,8.12 36.17,7.11 41.66,1.63 54.05,1.63 54.66,1.02 58.52,1.02 59.54,2.03 59.54,3.45 58.73,4.27 58.73,4.88 57.25,6.35 S2.1
N$8  (via drill 0.6)
  Top 0.203: IC5.11 40.55,17.97 v40.64,17.88 | IC3.10 65.43,11.58 65.43,16.26 | 65.43,16.26 65.43,20.83 IC2.10 | IC1.10 43.99,21.03 45.11,19.91 45.11,17.68 46.53,16.26 65.43,16.26
  Bottom 0.203: v40.64,17.88 43.28,17.88 43.48,18.09 43.48,20.93 IC1.10
N$9  (via drill 0.6)
  Top 0.203: JP2.2 34.29,6.04 34.75,6.5 34.75,8.04 IC5.41 34.75,8.3 34.75,9.35 35.56,10.16 35.56,11.58 34.95,12.19 v33.73,12.19 | R2.1 31.78,28.57 v32.92,27.43
  Bottom 0.203: v32.92,27.43 32.92,21.54 33.73,20.73 v33.73,12.19
N$10
  Top 0.203: T1.1 29.98,31.22 R2.2
N$11  (via drill 0.6)
  Top 0.203: JP2.3 36.83,5.23 35.56,6.5 35.56,8.03 IC5.42 35.42,9.21 35.97,9.75 37.19,9.75 38,8.94 39.83,8.94 v40.23,8.53 | v51,18.29 51,18.9 | 51,18.9 51,20.83 IC1.13 | IC3.13 74.07,10.26 73.15,11.18 73.15,20.73 IC2.13 72.85,22.25 70.1,24.99 61.98,24.99 60.96,23.98 60.96,19.51 60.35,18.9 51,18.9
  Bottom 0.203: v40.23,8.53 49.17,8.53 51,10.36 v51,18.29
N$12
  Top 0.203: IC5.15 34.75,19.9 34.75,21.34 35.76,22.35 38.81,22.35 40.03,23.57 45.52,23.57 46.13,22.96 IC1.11 46.13,18.69 47.95,16.87 55.07,16.87 55.88,17.68 61.37,17.68 63.2,19.51 63.6,19.51 64.01,19.91 64.01,22.35 64.41,22.76 67.06,22.76 67.46,22.35 67.46,21.34 IC2.11 67.87,20.93 67.87,11.18 68.78,10.26 IC3.11
N$13
  Top 0.203: IC5.16 33.82,21.02 35.56,22.76 38.61,22.76 39.83,23.98 47.75,23.98 48.56,23.16 48.56,21.13 IC1.12 48.67,17.98 49.17,17.48 54.86,17.48 55.47,18.09 60.55,18.09 61.57,19.1 61.57,23.98 62.18,24.59 69.49,24.59 70.1,23.98 70.1,21.23 IC2.12 70.71,20.62 70.71,10.97 71.42,10.26 IC3.12
N$14  (via drill 0.6)
  Top 0.203: IC5.14 35.42,21.2 35.76,21.54 v38,21.54 | v38.2,23.77 38.61,23.77 39.22,24.38 53.03,24.38 53.65,23.77 53.65,21.13 IC1.14
  Bottom 0.203: v38,21.54 38,23.57 v38.2,23.77
N$15  (via drill 0.6)
  Top 0.203: v44.3,19.1 42.98,19.1 IC1.9 | v74.17,19.91 74.27,19.91 IC2.14
  Bottom 0.203: v74.17,19.91 73.76,19.51 44.7,19.51 v44.3,19.1
N$16
  Top 0.203: IC2.9 62.69,22.25 63.8,23.37 67.87,23.37 68.48,22.76 68.48,22.55 68.68,22.35 68.68,19.3 68.28,18.9 68.28,13.41 70.31,11.38 70.31,9.35 71.12,8.53 76.2,8.53 76.81,9.14 76.81,10.16 IC3.14
N$17
  Top 0.203: T2.1 72.88,31.16 IC2.3
N$18
  Top 0.203: T3.1 68.82,32.68 IC2.4
N$19
  Top 0.203: IC2.5 70.1,28.85 70.1,30.28 69.49,30.89 67.87,30.89 65.56,33.19 65.56,35.98 T4.1
N$20
  Top 0.203: T5.1 63.23,36.54 65.02,34.75 65.02,32.72 66.85,30.89 66.85,29.57 IC2.6
N$21
  Top 0.203: T6.1 57.23,36.03 57.51,35.76 57.51,33.53 57.71,33.33 63.4,33.33 64.21,32.51 64.21,29.67 IC2.7
N$22  (via drill 0.6)
  Top 0.203: IC3.15 79.45,8.53 79.86,8.13 83.31,8.13 83.92,8.74 v83.92,27.84 | v86.77,27.84 87.99,27.84 88.19,28.04 88.19,34.14 87.99,34.34 85.14,34.34 84.73,34.75 84.73,36.78 T7.1
  Bottom 0.203: v83.92,27.84 v86.77,27.84
N$23  (via drill 0.6)
  Top 0.203: v82.5,36.37 82.3,36.58 81.02,36.58 T8.1
  Bottom 0.203: IC3.1 81.99,28.96 82.5,29.46 v82.5,36.37
N$24  (via drill 0.6)
  Top 0.203: v79.25,30.07 79.25,33.12 79.05,33.33 77.01,33.33 76.4,33.93 76.4,36.2 T9.1
  Bottom 0.203: IC3.2 79.45,29.87 v79.25,30.07
N$25
  Top 0.203: T10.1 85.87,33.44 84.73,32.31 84.73,8.94 83.52,7.72 79.05,7.72 78.44,8.33 78.44,16.05 78.03,16.46 78.03,16.76 IC3.3
N$26
  Top 0.203: T11.1 85.89,9.08 83.92,7.11 78.84,7.11 78.03,7.92 78.03,14.22 IC3.4
N$27
  Top 0.203: T12.1 56.02,39.15 55.47,38.61 54.25,38.61 53.85,38.2 53.85,36.98 54.05,36.78 55.27,36.78 55.88,36.17 55.88,35.08 R6.2
N$28  (via drill 0.6)
  Top 0.203: T13.1 62.42,39.99 v63.4,39.01 | R7.2 62.23,34.49 62.99,33.73 64.01,33.73 v64.21,33.93
  Bottom 0.203: v64.21,33.93 64.01,34.14 64.01,38.41 v63.4,39.01
N$29  (via drill 0.6)
  Top 0.203: T14.1 58.66,39.9 v58.93,39.62 | v59.13,36.17 59.13,34.88 R8.2
  Bottom 0.203: v58.93,39.62 58.93,36.37 v59.13,36.17
N$30
  Top 0.203: T15.1 52.76,35.1 R9.2
N$31
  Top 0.203: T16.1 48.8,35.96 R10.2
N$32
  Top 0.203: R11.2 47.75,35.84 47.75,38.61 47.55,38.81 47.55,39.55 T17.1
N$33
  Top 0.203: T18.1 44.94,36.03 R12.2
N$34
  Top 0.203: T19.1 41.08,35.37 R13.2
N$35  (via drill 0.6)
  Top 0.203: T20.1 74.97,40.05 v75.18,40.03 | v74.78,36.37 74.78,34.98 R14.2
  Bottom 0.203: v75.18,40.03 75.18,36.78 v74.78,36.37
N$36  (via drill 0.6)
  Top 0.203: v79.25,36.37 79.43,36.37 R15.2 | T21.1 80.23,39.99 v80.26,40.03
  Bottom 0.203: v80.26,40.03 80.26,37.39 v79.25,36.37
N$37  (via drill 0.6)
  Top 0.203: R16.2 78.56,34.83 79.86,33.53 82.3,33.53 v83.31,32.51 | v84.73,40.23 83.26,40.23 T22.1
  Bottom 0.203: v83.31,32.51 83.72,32.51 84.33,33.12 84.33,39.83 v84.73,40.23
N$38  (via drill 0.6)
  Top 0.203: R6.1 56.03,31.04 55.27,30.28 55.27,26.42 v55.47,26.21
  Bottom 0.203: v55.47,26.21 55.47,21.84 IC1.15
N$39
  Top 0.203: R7.1 62.23,32.05 IC1.1
N$40
  Top 0.203: R8.1 59.18,31.55 IC1.2
N$41
  Top 0.203: R9.1 52.88,29.52 IC1.3
N$42
  Top 0.203: R10.1 49.84,30.02 IC1.4
N$43
  Top 0.203: R11.1 46.79,30.53 IC1.5
N$44
  Top 0.203: R12.1 43.74,31.04 IC1.6
N$45
  Top 0.203: R13.1 40.69,31.55 IC1.7
N$46  (via drill 0.6)
  Top 0.203: R14.1 74.83,31.85 76.61,30.07 76.61,27.03 v76.81,26.82
  Bottom 0.203: v76.81,26.82 76.81,22.15 IC2.15
N$47
  Top 0.203: IC2.1 80.47,31.62 R15.1
N$48
  Top 0.203: IC2.2 77.93,31.98 R16.1
N$49
  Top 0.203: T2.2 72.88,39.29 72.75,39.42 72.75,43.1 R4.1
N$50
  Top 0.203: T3.2 68.82,40.53 R5.1
N$51
  Top 0.203: T4.2 64.96,40.93 R17.1
N$52
  Top 0.203: T5.2 61.09,39.08 60.76,39.42 60.76,43.3 R18.1
N$53
  Top 0.203: T6.2 57.23,42.33 56.9,42.67 53.06,42.67 R19.1
N$54
  Top 0.203: T7.2 85.28,38.74 85.75,39.22 85.75,43.51 R20.1
N$55
  Top 0.203: T8.2 80.81,38.95 82.09,40.23 82.09,43.91 R21.1
N$56
  Top 0.203: T9.2 76.94,38.95 77.83,39.83 77.83,43.51 R22.1
N$57
  Top 0.203: T10.2 85.89,37.32 86.56,38 86.56,40.26 R23.1
N$58  (via drill 0.6)
  Top 0.203: 86.22,31.63 T11.2 86.83,30.68 v87.38,30.68 | v89.2,34.54 89.2,35.99 R24.1
  Bottom 0.203: v87.38,30.68 88.59,30.68 88.8,30.89 88.8,34.14 v89.2,34.54
N$59  (via drill 0.6)
  Top 0.203: IC6.14 5.71,28.63 6.3,28.04 v7.32,28.04
  Bottom 0.203: v7.32,28.04 7.32,18.09 5.08,15.85 3.86,15.85 1.83,13.82 1.83,11.18 1.42,10.77 1.42,2.23 2.23,1.42 3.45,1.42 3.86,1.02 92.2,1.02 U$1.+2 94.34,3.4 87.99,9.75 87.99,18.14 U$1.+1
N$60
  Top 0.203: IC5.2 40.03,10.77 44.7,6.1 Q1.2 45.01,4.54 C4.1
N$61
  Top 0.203: IC5.3 42.81,11.57 Q1.1 48.49,5.89 51,5.89 52.02,4.88 52.02,3.45 52.63,2.85 54.46,2.85 54.86,3.25 54.86,6.3 53.77,7.39 C3.2
N$62
  Top 0.203: IC5.4 41.05,12.37 R3.2
R1  (via drill 0.6)
  Top 0.203: R5.2 68.28,44.5 v66.45,46.33
  Bottom 0.203: v66.45,46.33 64.01,48.77 37.39,48.77 35.97,47.35 35.97,45.31 CON1.25
R2  (via drill 0.6)
  Top 0.203: R4.2 69.72,46.71 v69.29,47.14
  Bottom 0.203: v69.29,47.14 66.85,49.58 35.36,49.58 33.33,47.55 33.33,45.41 CON1.23
R3  (via drill 0.6)
  Top 0.203: R24.2 90.4,39.6 91.64,40.84 v91.64,42.47
  Bottom 0.203: v91.64,42.47 91.64,47.35 89,49.99 25.4,49.99 24.38,48.97 CON1.16
R4
  Top 0.203: R23.2 88.39,49.38 87.58,50.19 27.64,50.19 25.81,48.36 25.81,45.31 CON1.17
R5
  Top 0.203: R22.2 77.62,47.75 76.81,48.56 31.29,48.56 30.68,47.95 30.68,45.52 CON1.21
R6
  Top 0.203: R21.2 81.89,48.56 81.08,49.38 29.06,49.38 28.25,48.56 28.25,45.41 CON1.19
R7
  Top 0.203: R20.2 85.14,49.17 84.53,49.78 28.25,49.78 26.82,48.36 26.82,46.84 CON1.18
R8  (via drill 0.6)
  Top 0.203: R19.2 52.4,45.9 v50.19,43.69
  Bottom 0.203: v50.19,43.69 46.74,43.69 44.7,41.66 21.95,41.66 20.52,43.08 20.52,45.52 CON1.12
R9  (via drill 0.6)
  Top 0.203: R18.2 61.19,46.71 v58.12,46.74
  Bottom 0.203: v58.12,46.74 55.68,46.74 54.86,45.92 46.74,45.92 43.69,42.88 24.59,42.88 24.38,43.08 CON1.15
R10  (via drill 0.6)
  Top 0.203: v64.21,46.53 64.21,44.48 R17.2
  Bottom 0.203: CON1.26 37.08,47.04 38.41,48.36 62.99,48.36 64.21,47.14 v64.21,46.53
S1  (via drill 0.6)
  Top 0.203: T12.3 51.26,40.79 v50.8,41.25
  Bottom 0.203: v50.8,41.25 20.52,41.25 19.3,42.47 CON1.11
S2  (via drill 0.6)
  Top 0.203: T13.3 59.71,41.83 59.94,42.06 59.94,45.31 59.74,45.52 v56.69,45.52
  Bottom 0.203: v56.69,45.52 46.94,45.52 43.89,42.47 23.98,42.47 23.16,43.28 23.16,45.41 CON1.14
S3  (via drill 0.6)
  Top 0.203: T14.3 55.42,43.54 v54.66,44.3
  Bottom 0.203: v54.66,44.3 51.41,44.3 51,44.7 46.94,44.7 44.3,42.06 22.35,42.06 21.74,42.67 21.74,44.09 CON1.13
S4
  Top 0.203: T15.3 50.56,39.86 49.58,40.84 49.58,42.27 48.97,42.88 45.72,42.88 44.3,41.45 35.97,41.45 34.34,43.08 18.29,43.08 18.09,43.28 18.09,45.41 CON1.10
S5
  Top 0.203: T16.3 46.6,38.74 45.92,39.42 42.67,39.42 42.27,39.83 36.37,39.83 33.93,42.27 16.05,42.27 15.44,42.88 15.44,45.52 CON1.8
S6
  Top 0.203: CON1.9 16.87,44.09 16.87,43.08 17.27,42.67 34.14,42.67 35.76,41.05 45.69,41.05 T17.3 45.59,41.15
S7
  Top 0.203: T18.3 42.74,38.74 42.06,39.42 36.17,39.42 33.73,41.86 14.83,41.86 14.22,42.47 CON1.7
S8
  Top 0.203: T19.3 37.39,37.59 33.53,41.45 14.22,41.45 13.01,42.67 13.01,45.41 CON1.6
S9  (via drill 0.6)
  Top 0.203: v68.68,45.72 69.49,45.72 70.1,45.11 70.1,42.49 T20.3
  Bottom 0.203: CON1.24 34.54,47.55 36.17,49.17 65.23,49.17 v68.68,45.72
S10
  Top 0.203: CON1.22 32,47.45 32.72,48.16 74.17,48.16 74.78,47.55 74.78,43.28 76.4,41.66 76.4,41.22 T21.3
S11
  Top 0.203: CON1.20 29.46,48.16 30.28,48.97 78.64,48.97 79.86,47.75 79.86,42.88 80.47,42.27 80.47,41.77 T22.3
SCL  (via drill 0.6)
  Top 0.203: 24.77,16.23 R31.1 25.2,16.26 26.01,17.07 27.12,17.07 IC5.24 27.32,17.07 29.06,17.07 29.26,16.87 v29.26,16.26 | v3.66,13.41 3.66,13.82 0.61,16.87 0.61,24.59 3.05,27.03 3.05,30.38 IC6.16
  Bottom 0.203: v3.66,13.41 3.86,13.21 6.91,13.21 8.53,14.83 28.25,14.83 29.26,15.85 v29.26,16.26
SDA  (via drill 0.6)
  Top 0.203: R32.1 21.74,16.87 | 21.74,16.87 22.76,17.88 27.13,17.88 IC5.23 | 21.74,16.87 21.74,17.88 v21.34,18.29 | v18.9,18.29 18.49,18.29 17.68,19.1 10.97,19.1 v9.55,17.68 | v6.5,14.22 3.86,14.22 1.02,17.07 1.02,24.18 4.27,27.43 4.27,30.33 IC6.15
  Bottom 0.203: v21.34,18.29 v18.9,18.29 | v9.55,17.68 9.55,17.27 v6.5,14.22
VCC  (via drill 0.6)
  Top 0.203: 21.74,12.7 IC4.3 15.04,15.44 4.47,15.44 3.25,16.66 D2.C 3.25,18.49 | 21.74,12.7 23.06,12.7 24.79,14.43 | 24.79,14.43 25.2,14.83 27.16,14.83 IC5.27 31.03,14.77 | 31.03,14.77 32.92,16.66 32.92,19.67 IC5.17 | IC5.38 32.22,13.58 | 32.22,13.58 31.03,14.77 | IC5.5 36.37,13.17 | 36.37,13.17 32.63,13.17 32.22,13.58 | 21.74,12.7 R32.2 20.12,15.36 20.12,19.1 22.35,21.34 23.98,21.34 25.48,22.84 R1.2 | 3.25,18.49 4.47,19.71 4.47,21.28 IC6.2 | 3.25,18.49 2.23,19.51 2.23,23.57 5.49,26.82 16.05,26.82 17.25,25.63 R30.2 R29.2 | R3.1 41.6,18.54 41.25,18.9 39.22,18.9 | 39.22,18.9 38.2,18.9 36.37,17.07 36.37,13.17 | R31.2 24.79,14.43 | IC1.16 58.83,22.86 56.69,24.99 | 56.69,24.99 39.62,24.99 v39.22,25.4 | IC3.16 80.67,11.58 80.67,20.83 IC2.16 80.47,23.16 79.15,24.49 | 79.15,24.49 78.23,25.4 57.1,25.4 56.69,24.99 | T6.3 58.74,37.64 T5.3 62.7,37.49 T4.3 66.52,37.54 T3.3 70.63,37.64 T2.3 T9.3 78.55,37.69 T8.3 82.42,37.74 T7.3 82.5,37.8 83.31,36.98 83.31,34.77 T10.3 84.33,33.75 84.33,31.5 83.69,30.85 T11.3 83.69,29.02 79.15,24.49 | v39.22,21.54 39.22,18.9
  Top 0.406: IC4.3 C2.+
  Bottom 0.203: v39.22,25.4 v39.22,21.54

### Text on the board
tNames: 2 | 1
bNames: Belegung | qlocktwo V3